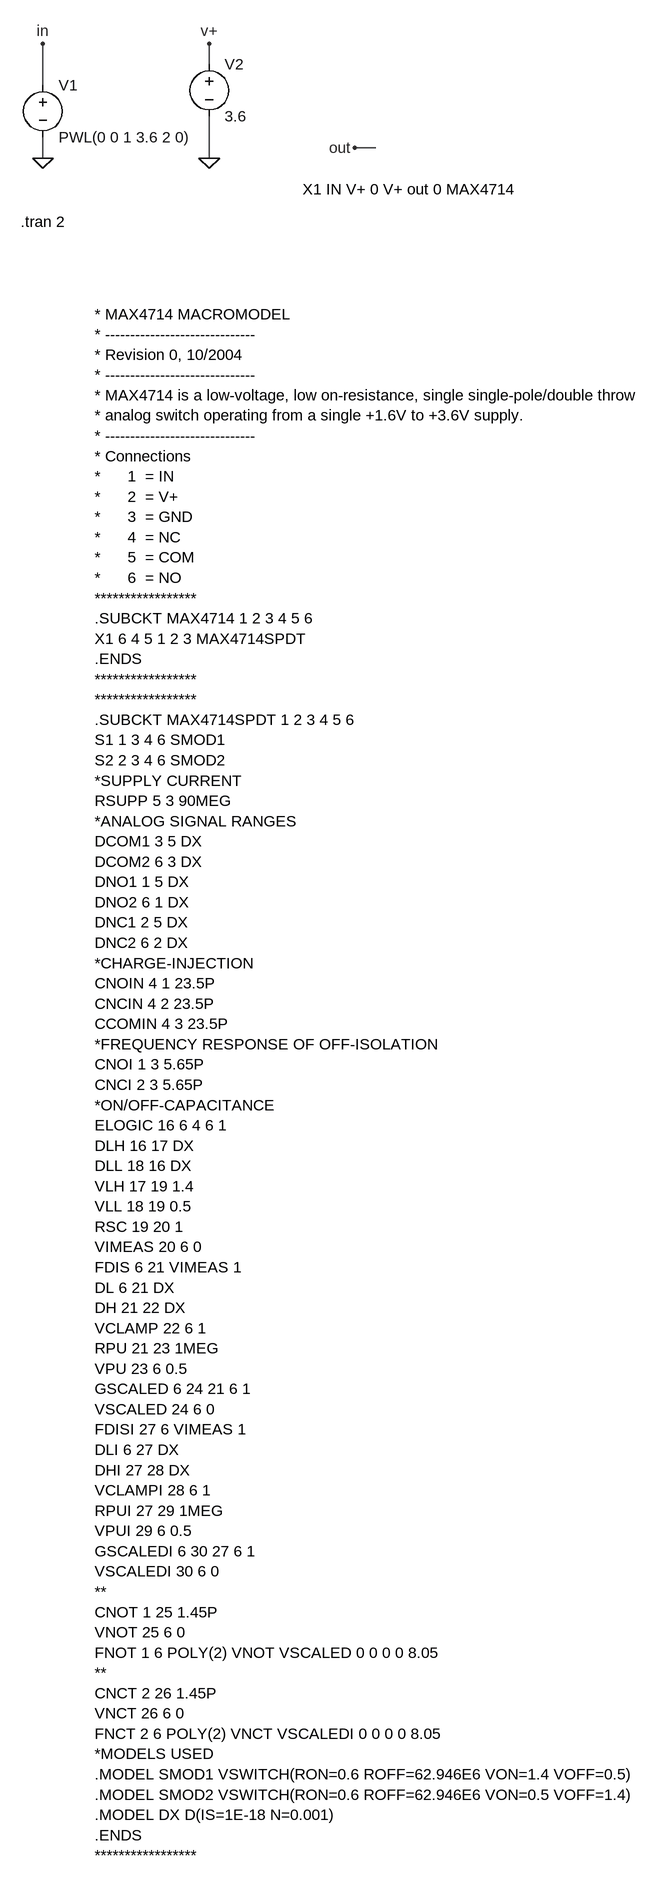
[diagram p0: schematic max4714.asc]
max4714.asc, the LTspice schematic file:
Version 4
SHEET 1 944 2400
WIRE 176 -144 176 -176
WIRE -80 -112 -80 -176
WIRE 432 -16 400 -16
WIRE -80 0 -80 -32
WIRE 176 0 176 -64
FLAG -80 0 0
FLAG 176 0 0
FLAG -80 -176 in
FLAG 176 -176 v+
FLAG 400 -16 out
SYMBOL voltage -80 -128 R0
WINDOW 123 0 0 Left 0
WINDOW 39 0 0 Left 0
SYMATTR InstName V1
SYMATTR Value PWL(0 0 1 3.6 2 0)
SYMBOL voltage 176 -160 R0
WINDOW 123 0 0 Left 0
WINDOW 39 0 0 Left 0
SYMATTR InstName V2
SYMATTR Value 3.6
TEXT 0 240 Left 0 !* MAX4714 MACROMODEL\n* ------------------------------\n* Revision 0, 10/2004\n* ------------------------------\n* MAX4714 is a low-voltage, low on-resistance, single single-pole/double throw\n* analog switch operating from a single +1.6V to +3.6V supply.\n* ------------------------------\n* Connections\n*      1  = IN\n*      2  = V+\n*      3  = GND\n*      4  = NC \n*      5  = COM\n*      6  = NO\n*****************\n.SUBCKT MAX4714 1 2 3 4 5 6\nX1 6 4 5 1 2 3 MAX4714SPDT\n.ENDS\n*****************\n***************** \n.SUBCKT MAX4714SPDT 1 2 3 4 5 6 \nS1 1 3 4 6 SMOD1\nS2 2 3 4 6 SMOD2\n*SUPPLY CURRENT\nRSUPP 5 3 90MEG\n*ANALOG SIGNAL RANGES\nDCOM1 3 5 DX\nDCOM2 6 3 DX\nDNO1 1 5 DX\nDNO2 6 1 DX\nDNC1 2 5 DX\nDNC2 6 2 DX\n*CHARGE-INJECTION\nCNOIN 4 1 23.5P\nCNCIN 4 2 23.5P\nCCOMIN 4 3 23.5P \n*FREQUENCY RESPONSE OF OFF-ISOLATION\nCNOI 1 3 5.65P\nCNCI 2 3 5.65P\n*ON/OFF-CAPACITANCE\nELOGIC 16 6 4 6 1\nDLH 16 17 DX\nDLL 18 16 DX\nVLH 17 19 1.4 \nVLL 18 19 0.5\nRSC 19 20 1\nVIMEAS 20 6 0\nFDIS 6 21 VIMEAS 1\nDL 6 21 DX\nDH 21 22 DX\nVCLAMP 22 6 1\nRPU 21 23 1MEG\nVPU 23 6 0.5\nGSCALED 6 24 21 6 1\nVSCALED 24 6 0\nFDISI 27 6 VIMEAS 1\nDLI 6 27 DX\nDHI 27 28 DX\nVCLAMPI 28 6 1\nRPUI 27 29 1MEG\nVPUI 29 6 0.5\nGSCALEDI 6 30 27 6 1\nVSCALEDI 30 6 0\n**\nCNOT 1 25 1.45P\nVNOT 25 6 0\nFNOT 1 6 POLY(2) VNOT VSCALED 0 0 0 0 8.05\n**\nCNCT 2 26 1.45P\nVNCT 26 6 0\nFNCT 2 6 POLY(2) VNCT VSCALEDI 0 0 0 0 8.05\n*MODELS USED\n.MODEL SMOD1 VSWITCH(RON=0.6 ROFF=62.946E6 VON=1.4 VOFF=0.5)\n.MODEL SMOD2 VSWITCH(RON=0.6 ROFF=62.946E6 VON=0.5 VOFF=1.4)\n.MODEL DX D(IS=1E-18 N=0.001)\n.ENDS\n*****************
TEXT -114 98 Left 0 !.tran 2
TEXT 320 48 Left 0 !X1 IN V+ 0 V+ out 0 MAX4714

The netlist it stands for:
* max4714.asc
V1 in 0 PWL(0 0 1 3.6 2 0)
V2 v+ 0 3.6
* MAX4714 MACROMODEL
* ------------------------------
* Revision 0, 10/2004
* ------------------------------
* MAX4714 is a low-voltage, low on-resistance, single single-pole/double throw
* analog switch operating from a single +1.6V to +3.6V supply.
* ------------------------------
* Connections
*      1  = IN
*      2  = V+
*      3  = GND
*      4  = NC
*      5  = COM
*      6  = NO
*****************
.SUBCKT MAX4714 1 2 3 4 5 6
X1 6 4 5 1 2 3 MAX4714SPDT
.ENDS
*****************
*****************
.SUBCKT MAX4714SPDT 1 2 3 4 5 6
S1 1 3 4 6 SMOD1
S2 2 3 4 6 SMOD2
*SUPPLY CURRENT
RSUPP 5 3 90MEG
*ANALOG SIGNAL RANGES
DCOM1 3 5 DX
DCOM2 6 3 DX
DNO1 1 5 DX
DNO2 6 1 DX
DNC1 2 5 DX
DNC2 6 2 DX
*CHARGE-INJECTION
CNOIN 4 1 23.5P
CNCIN 4 2 23.5P
CCOMIN 4 3 23.5P
*FREQUENCY RESPONSE OF OFF-ISOLATION
CNOI 1 3 5.65P
CNCI 2 3 5.65P
*ON/OFF-CAPACITANCE
ELOGIC 16 6 4 6 1
DLH 16 17 DX
DLL 18 16 DX
VLH 17 19 1.4
VLL 18 19 0.5
RSC 19 20 1
VIMEAS 20 6 0
FDIS 6 21 VIMEAS 1
DL 6 21 DX
DH 21 22 DX
VCLAMP 22 6 1
RPU 21 23 1MEG
VPU 23 6 0.5
GSCALED 6 24 21 6 1
VSCALED 24 6 0
FDISI 27 6 VIMEAS 1
DLI 6 27 DX
DHI 27 28 DX
VCLAMPI 28 6 1
RPUI 27 29 1MEG
VPUI 29 6 0.5
GSCALEDI 6 30 27 6 1
VSCALEDI 30 6 0
**
CNOT 1 25 1.45P
VNOT 25 6 0
FNOT 1 6 POLY(2) VNOT VSCALED 0 0 0 0 8.05
**
CNCT 2 26 1.45P
VNCT 26 6 0
FNCT 2 6 POLY(2) VNCT VSCALEDI 0 0 0 0 8.05
*MODELS USED
.MODEL SMOD1 VSWITCH(RON=0.6 ROFF=62.946E6 VON=1.4 VOFF=0.5)
.MODEL SMOD2 VSWITCH(RON=0.6 ROFF=62.946E6 VON=0.5 VOFF=1.4)
.MODEL DX D(IS=1E-18 N=0.001)
.ENDS
*****************
.tran 2
X1 IN V+ 0 V+ out 0 MAX4714
.backanno
.end